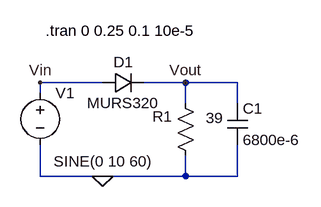
[diagram p0: schematic questao2_meia_onda_filtrado.asc]
questao2_meia_onda_filtrado.asc, the LTspice schematic file:
Version 4
SHEET 1 880 680
WIRE 96 -96 0 -96
WIRE 224 -96 160 -96
WIRE 304 -96 224 -96
WIRE 0 -80 0 -96
WIRE 224 -64 224 -96
WIRE 304 -64 304 -96
WIRE 0 48 0 0
WIRE 96 48 0 48
WIRE 224 48 224 16
WIRE 224 48 96 48
WIRE 304 48 304 0
WIRE 304 48 224 48
FLAG 224 -96 Vout
FLAG 0 -96 Vin
FLAG 96 48 0
SYMBOL diode 96 -80 R270
WINDOW 0 32 32 VTop 2
WINDOW 3 0 32 VBottom 2
SYMATTR InstName D1
SYMATTR Value MURS320
SYMBOL res 240 32 R180
WINDOW 0 36 76 Left 2
WINDOW 3 -42 74 Left 2
SYMATTR InstName R1
SYMATTR Value 39
SYMBOL voltage 0 -96 R0
WINDOW 123 0 0 Left 0
WINDOW 39 0 0 Left 0
WINDOW 3 21 121 Left 2
SYMATTR Value SINE(0 10 60)
SYMATTR InstName V1
SYMBOL cap 288 -64 R0
SYMATTR InstName C1
SYMATTR Value 6800e-6
TEXT 8 -176 Left 2 !.tran 0 0.25 0.1 10e-5

The netlist it stands for:
* questao2_meia_onda_filtrado.asc
D1 Vin Vout MURS320
R1 0 Vout 39
V1 Vin 0 SINE(0 10 60)
C1 Vout 0 6800e-6
.model D D
.lib standard.dio
.tran 0 0.25 0.1 10e-5
.backanno
.end